# EasyEDA Pro project opendeep.pba001.eval.v01.eprj

# Schematic opendeep.pba001.eval.v01
Board Name: opendeep.pba001.eval.v01; Create Date: 2026-03-10; Page Name: coreboard; Project Name: opendeep.pba001.eval.v01; Schematic Name: opendeep.pba001.eval.v01; Update Date: 2026-04-04; Company: EasyEDA.com; Page Size: A4; Version: V1.0
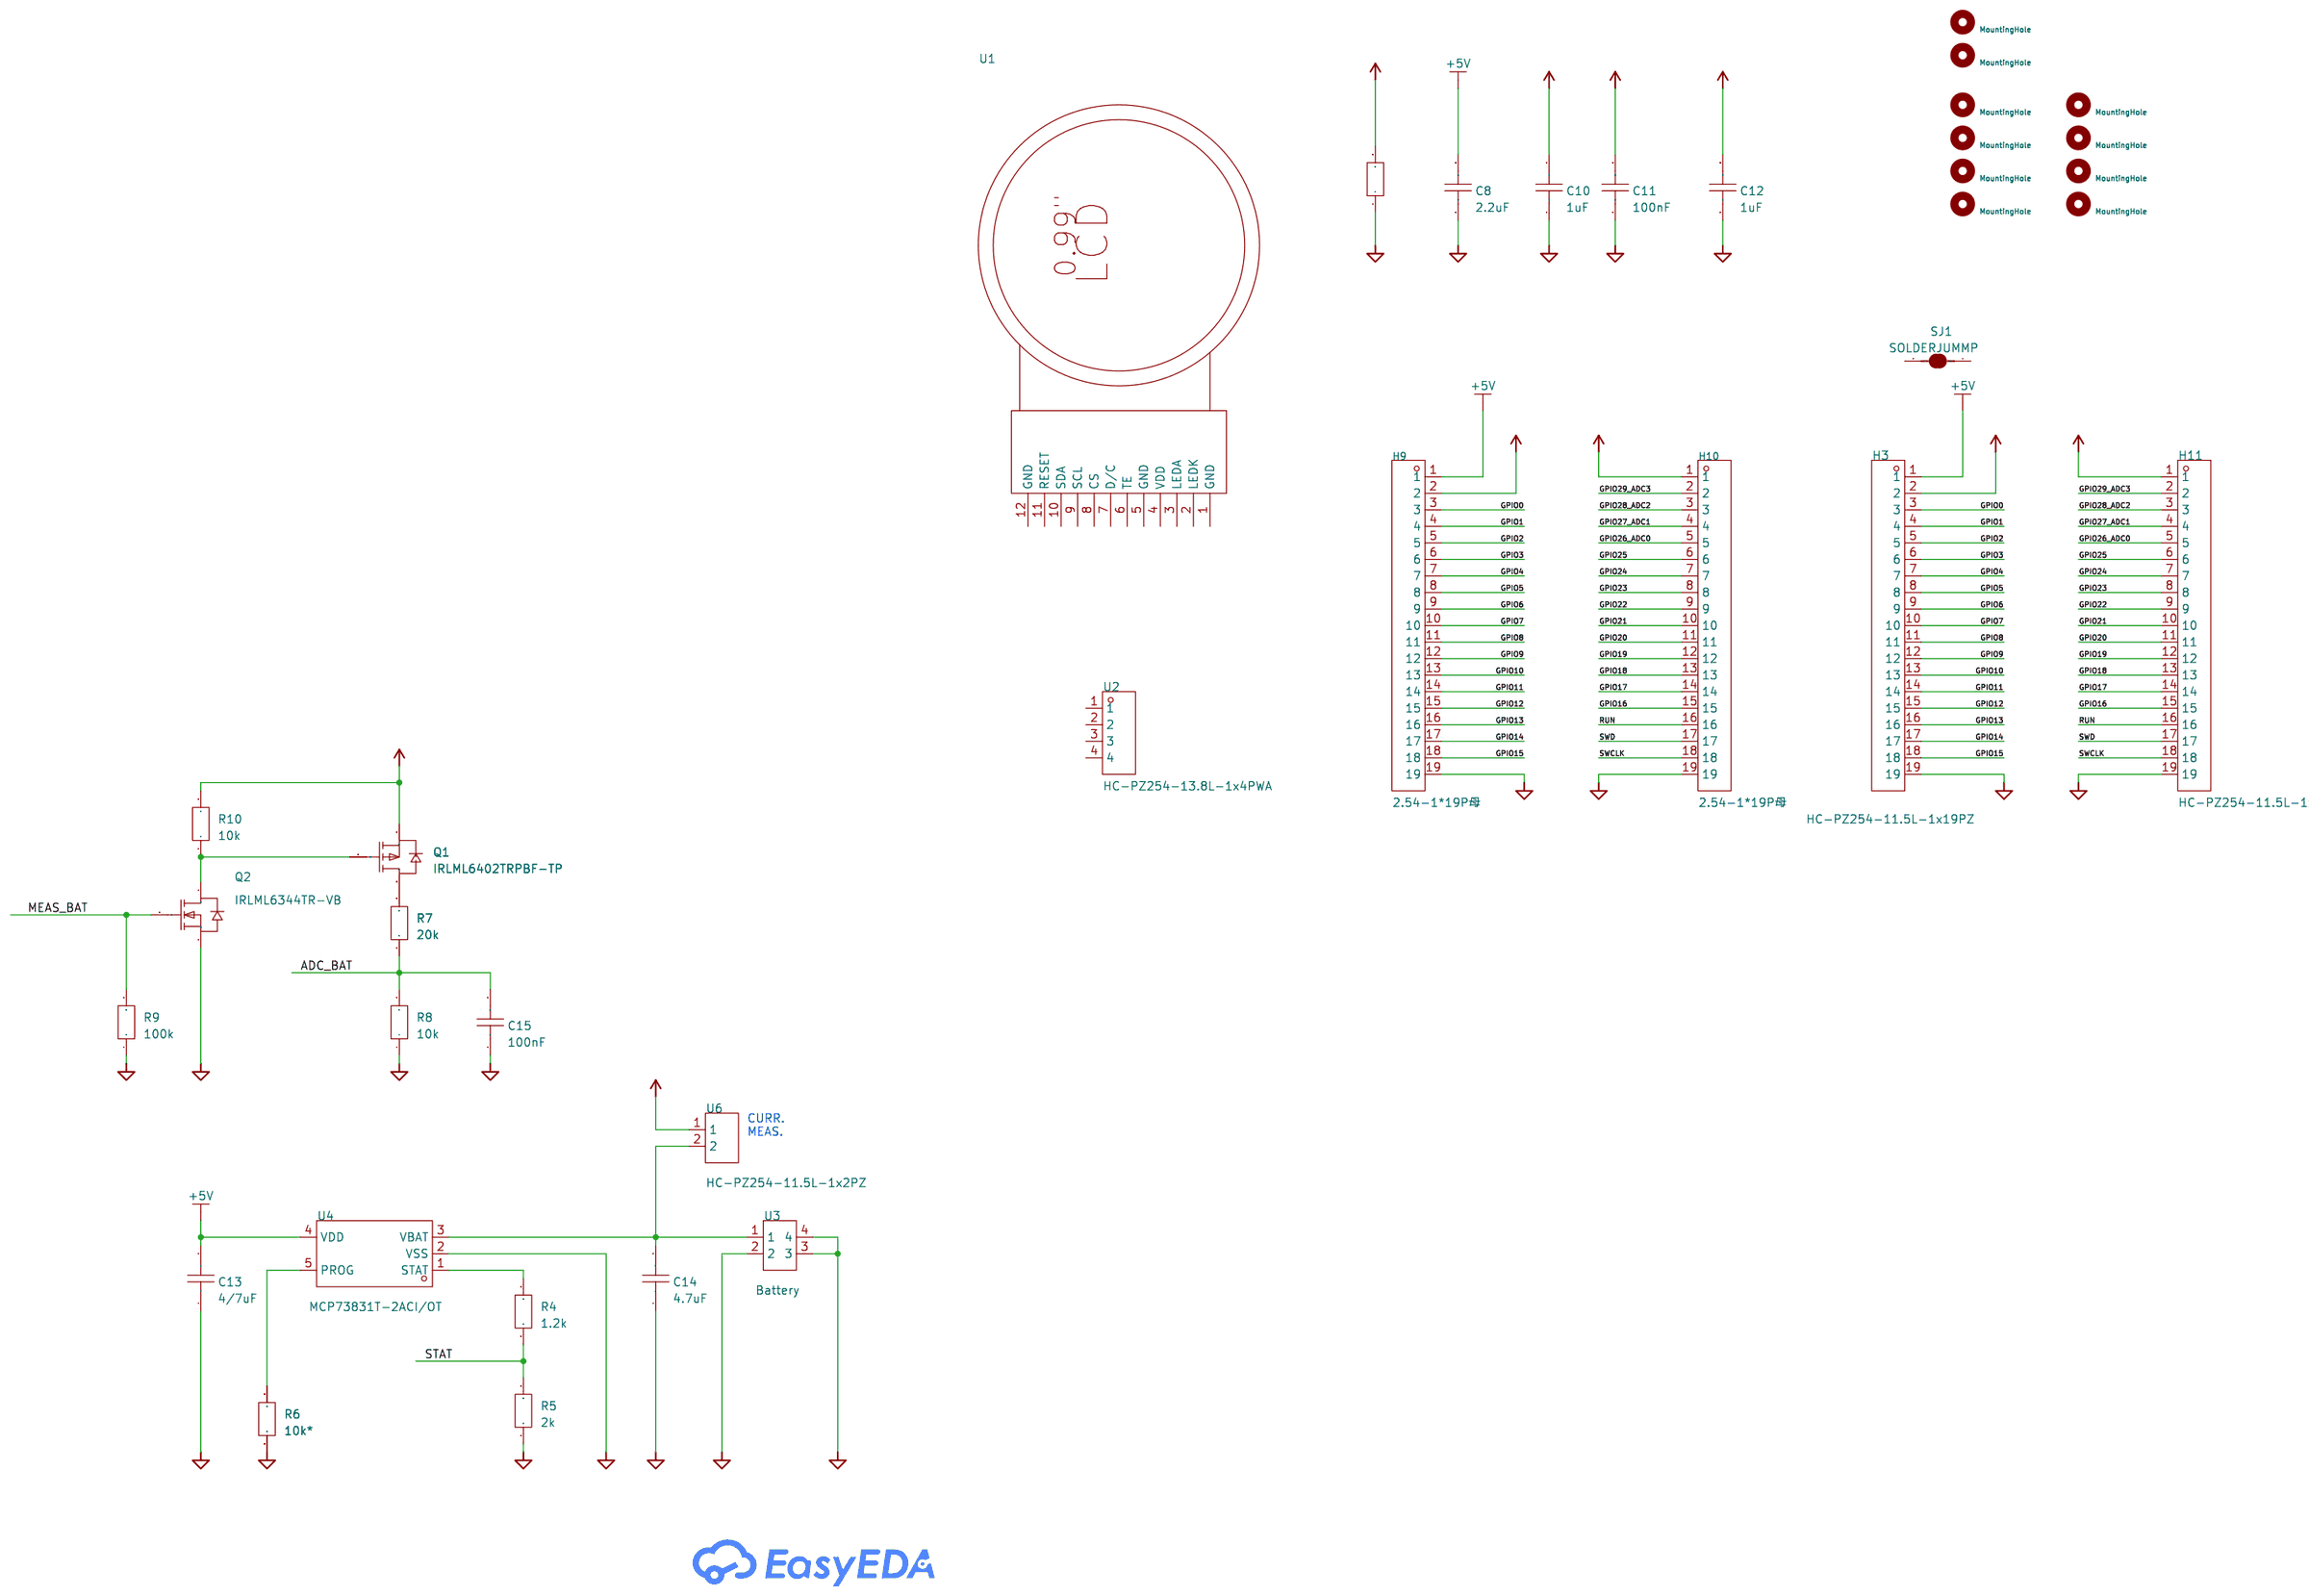
[diagram p0: schematic sheet]

## Parts
C8  2.2uF  [C0603]
C10  1uF  [C0603]
C11  100nF  [C0603]
C12  1uF  [C0603]
C13  4/7uF  [C0603]
C14  4.7uF  [C0603]
C15  100nF  [C0603]
H1  MountingHole  [MountingHole:MountingHole_2.7mm_M2.5]
H2  MountingHole  [MountingHole:MountingHole_2.7mm_M2.5]
H3  HC-PZ254-11.5L-1x19PZ  [HDR-TH_19P-P2.54-V-M]
H5  MountingHole  [MountingHole:MountingHole_2.7mm_M2.5]
H6  MountingHole  [MountingHole:MountingHole_2.7mm_M2.5]
H7  MountingHole  [MountingHole:MountingHole_2.7mm_M2.5]
H8  MountingHole  [MountingHole:MountingHole_2.7mm_M2.5]
H9  2.54-1*19P母  [HDR-TH_19P-P2.54-V-F]
H10  2.54-1*19P母  [HDR-TH_19P-P2.54-V-F]
H11  HC-PZ254-11.5L-1x19PZ  [HDR-TH_19P-P2.54-V-M]
H12  MountingHole  [MountingHole:MountingHole_2.7mm_M2.5]
H13  MountingHole  [MountingHole:MountingHole_2.7mm_M2.5]
H14  MountingHole  [MountingHole:MountingHole_2.7mm_M2.5]
H15  MountingHole  [MountingHole:MountingHole_2.7mm_M2.5]
Q1  IRLML6402TRPBF-TP  [SOT-23-3_L2.9-W1.3-P1.90-LS2.4-BR]
Q2  IRLML6344TR-VB  [SOT-23-3_L2.9-W1.3-P1.90-LS2.4-BR]
R3  DNF  [R0603]
R4  1.2k  [R0603]
R5  2k  [R0603]
R6  10k*  [R0603]
R7  20k  [R0603]
R8  10k  [R0603]
R9  100k  [R0603]
R10  10k  [R0603]
SJ1  SOLDERJUMMP  [SJ_2S-NO]
U1  -  [LCD 0.99 bottom]
U2  HC-PZ254-13.8L-1x4PWA  [HDR-TH_4P-P2.54-H-M_HC-PZ254-13.8L-1X4PWA]
U3  Battery  [CONN-SMD_2.0-2PWT]
U4  MCP73831T-2ACI/OT  [SOT-23-5_L3.0-W1.7-P0.95-LS2.8-BL]
U6  HC-PZ254-11.5L-1x2PZ  [CONN-TH_HC-PZ254-11.5L-1X2PZ]

## Library data of the parts
C8 C10-C15 = C0603C102J2GECAUTO: LCSC Part Name: 1nF ±5% 200V; Supplier Part: C2169812; Manufacturer: KEMET(基美); Supplier Footprint: 0603; JLCPCB Part Class: Extended Part; Datasheet: https://item.szlcsc.com/datasheet/C0603C102J2GECAUTO/2261877.html; Supplier: LCSC; Tolerance: ±5%; Voltage Rating: 200V; Temperature Coefficient: C0G
H1 H5-H8 H12-H15 = Mechanical_MountingHole: Attribute1: H2
H2 = Mechanical_MountingHole
H3 H11 = HC-PZ254-11.5L-1x19PZ: LCSC Part Name: 1x19P 间距:2.54mm 方针 直插; Supplier Part: C27985198; Manufacturer: HC(虹成电子); Supplier Footprint: 插件,P=2.54mm; JLCPCB Part Class: Extended Part; Datasheet: https://item.szlcsc.com/datasheet/HC-PZ254-11.5L-1x19PZ/29721156.html; Supplier: LCSC; Pin Structure: 1x19P; Pitch: 2.54mm; Circluar Pins/Square Pins: Pin Header; Mounting Type: Through Hole; Number of Rows: 1; Number of Pins: 19P; Current Rating: 3A; Length of Mating Pin: 6mm; Insulation Height: 2.5mm; Length of End Connection Pin: 3mm; Contact Material: Brass; Contact Plating: Gold; Operating Temperature: -40℃~+105℃; Color: Black
H9 H10 = 2.54-1*19P母: LCSC Part Name: 间距:2.54mm 直插; Supplier Part: C319202; Manufacturer: BOOMELE(博穆精密); Supplier Footprint: 插件,P=2.54mm; JLCPCB Part Class: Extended Part; Supplier: LCSC; Pitch: 2.54mm; Circular Hole / Square Hole: Square Hole; Mounting Type: Through Hole; Number of Rows: 1; Number of Positions: 19P; Holes Direction: Top
Q1 = IRLML6402TRPBF-TP: Supplier Part: C52205420; Manufacturer: TECH PUBLIC(台舟); Supplier Footprint: SOT-23; JLCPCB Part Class: Extended Part; Datasheet: https://item.szlcsc.com/datasheet/IRLML6402TRPBF-TP/55048147.html; Supplier: LCSC
Q2 = IRLML6344TR-VB: LCSC Part Name: 1个N沟道 耐压:30V 电流:6.5A; Supplier Part: C693370; Manufacturer: VBsemi(微碧半导体); Supplier Footprint: SOT-23; JLCPCB Part Class: Extended Part; Datasheet: https://atta.szlcsc.com/upload/public/pdf/source/20221101/67F54E55C74FC40D8CBA5BD6D3D7D1EA.pdf; Supplier: LCSC; Type: 1 N-channel; Drain to Source Voltage: 30V; Current - Continuous Drain(Id): 6.5A; Pd - Power Dissipation: 1.1W; Gate Threshold Voltage (Vgs(th)@Id): 2V; Gate Charge(Qg): 4.5nC@10V; Input Capacitance(Ciss@Vds): 335pF@15V; Operating Temperature: -55℃~+150℃
R3-R10 = RCC06031K50FKEA: LCSC Part Name: 厚膜电阻 1.5kΩ ±1% 200mW; Supplier Part: C4303195; Manufacturer: VISHAY(威世); Supplier Footprint: 0603; JLCPCB Part Class: Extended Part; Datasheet: https://item.szlcsc.com/datasheet/RCC06031K50FKEA/4873636.html; Supplier: LCSC; Type: Thick Film Resistor; Tolerance: ±1%; Power(Watts): 200mW; Temperature Coefficient: ±100ppm/℃; Operating Temperature: -55℃~+155℃
SJ1 = SOLDERJUMPERNO: Contributor: SparkFun; spicePre: S
U1 = LCD 0.99
U2 = HC-PZ254-13.8L-1x4PWA: LCSC Part Name: 1x4P 间距:2.54mm 方针 弯插; Supplier Part: C27985202; Manufacturer: HC(虹成电子); Supplier Footprint: 弯插,P=2.54mm; JLCPCB Part Class: Extended Part; Datasheet: https://atta.szlcsc.com/upload/public/pdf/source/20250106/2DDD59100DBA84A77921F70A33D05F25.pdf; Supplier: LCSC; Pin Structure: 1x4P; Pitch: 2.54mm; Circluar Pins/Square Pins: Policy; Mounting Type: Right-Angle; Number of Rows: Single Row; Number of Pins: 4P; Current Rating: 3A; Length of Mating Pin: 6mm; Insulation Height: 2.5mm; Length of End Connection Pin: 3mm; Contact Material: Brass; Contact Plating: Gold; Operating Temperature: -40℃~+105℃; Color: Black
U3 = Battery: Supplier Part: C9900011133; JLCPCB Part Class: Extended Part; Supplier: LCSC
U4 = MCP73831T-2ACI/OT: LCSC Part Name: 单节锂离子/锂聚合物充电管理控制器; Supplier Part: C424093; Manufacturer: MICROCHIP(美国微芯); Supplier Footprint: SOT-23-5; JLCPCB Part Class: Extended Part; Datasheet: https://item.szlcsc.com/datasheet/MCP73831T-2ACI%252FOT/417116.html; Supplier: LCSC; The Chip Type: Charging IC; Voltage - Supply: 3.75V~6V; Charge Current - Max: 550mA; Charging Saturation Voltage: 4.2V; Type of Battery: Lithium Battery; Number of Cells: 1; Operating Temperature: -40℃~+85℃; Battery Temperature Detection: Not supported; Supply Current (Iq): 53uA
U6 = HC-PZ254-11.5L-1x2PZ: LCSC Part Name: 1x2P 间距:2.54mm 方针 直插; Supplier Part: C27985187; Manufacturer: HC(虹成电子); Supplier Footprint: 插件,P=2.54mm; JLCPCB Part Class: Extended Part; Datasheet: https://item.szlcsc.com/datasheet/HC-PZ254-11.5L-1x2PZ/29721145.html; Supplier: LCSC; Pin Structure: 1x2P; Pitch: 2.54mm; Circluar Pins/Square Pins: Pin Header; Mounting Type: Through Hole; Number of Rows: 1; Number of Pins: 2P; Current Rating: 3A; Length of Mating Pin: 6mm; Insulation Height: 2.5mm; Length of End Connection Pin: 3mm; Contact Material: Brass; Contact Plating: Gold; Operating Temperature: -40℃~+105℃; Color: Black

## Nets
+5V: C8.2 C13.2 H3.1 H9.1 U4.4(VDD)
ADC_BAT: C15.2 R7.1 R8.2
GPIO0: H3.3 H9.3
GPIO1: H3.4 H9.4
GPIO2: H3.5 H9.5
GPIO3: H3.6 H9.6
GPIO4: H3.7 H9.7
GPIO5: H3.8 H9.8
GPIO6: H3.9 H9.9
GPIO7: H3.10 H9.10
GPIO8: H3.11 H9.11
GPIO9: H3.12 H9.12
GPIO10: H3.13 H9.13
GPIO11: H3.14 H9.14
GPIO12: H3.15 H9.15
GPIO13: H3.16 H9.16
GPIO14: H3.17 H9.17
GPIO15: H3.18 H9.18
GPIO16: H10.15 H11.15
GPIO17: H10.14 H11.14
GPIO18: H10.13 H11.13
GPIO19: H10.12 H11.12
GPIO20: H10.11 H11.11
GPIO21: H10.10 H11.10
GPIO22: H10.9 H11.9
GPIO23: H10.8 H11.8
GPIO24: H10.7 H11.7
GPIO25: H10.6 H11.6
GPIO26_ADC0: H10.5 H11.5
GPIO27_ADC1: H10.4 H11.4
GPIO28_ADC2: H10.3 H11.3
GPIO29_ADC3: H10.2 H11.2
MEAS_BAT: Q2.1(G) R9.2
POWER_+3V3: C10.2 C11.2 C12.2 H3.2 H9.2 H10.1 H11.1 R3.2
POWER_BAT: Q1.2(S) R10.2 U6.1
POWER_GND: C8.1 C10.1 C11.1 C12.1 C13.1 C14.1 C15.1 H3.19 H9.19 H10.19 H11.19 Q2.2(S) R3.1 R5.1 R6.1 R8.1 R9.1 U3.2 U3.3 U3.4 U4.2(VSS)
RUN: H10.16 H11.16
STAT: R4.1 R5.2
SWCLK: H10.18 H11.18
SWD: H10.17 H11.17
$1N21301: R4.2 U4.1(STAT)
$1N21392: R6.2 U4.5(PROG)
$1N21513: C14.2 U3.1 U4.3(VBAT) U6.2
$1N22911: Q1.3(D) R7.2
$1N22991: Q1.1(G) Q2.3(D) R10.1

Not connected (* = marked no-connect by the designer): SJ1 1 2; U1 1(GND) 2(LEDK) 3(LEDA) 4(VDD) 5(GND) 6(TE) 7(D/C) 8(CS) 9(SCL) 10(SDA) 11(RESET) 12(GND); U2 1 2 3 4

## Notes on the sheet
- CURR.
  MEAS.

# Board opendeep.pba001.eval.v01
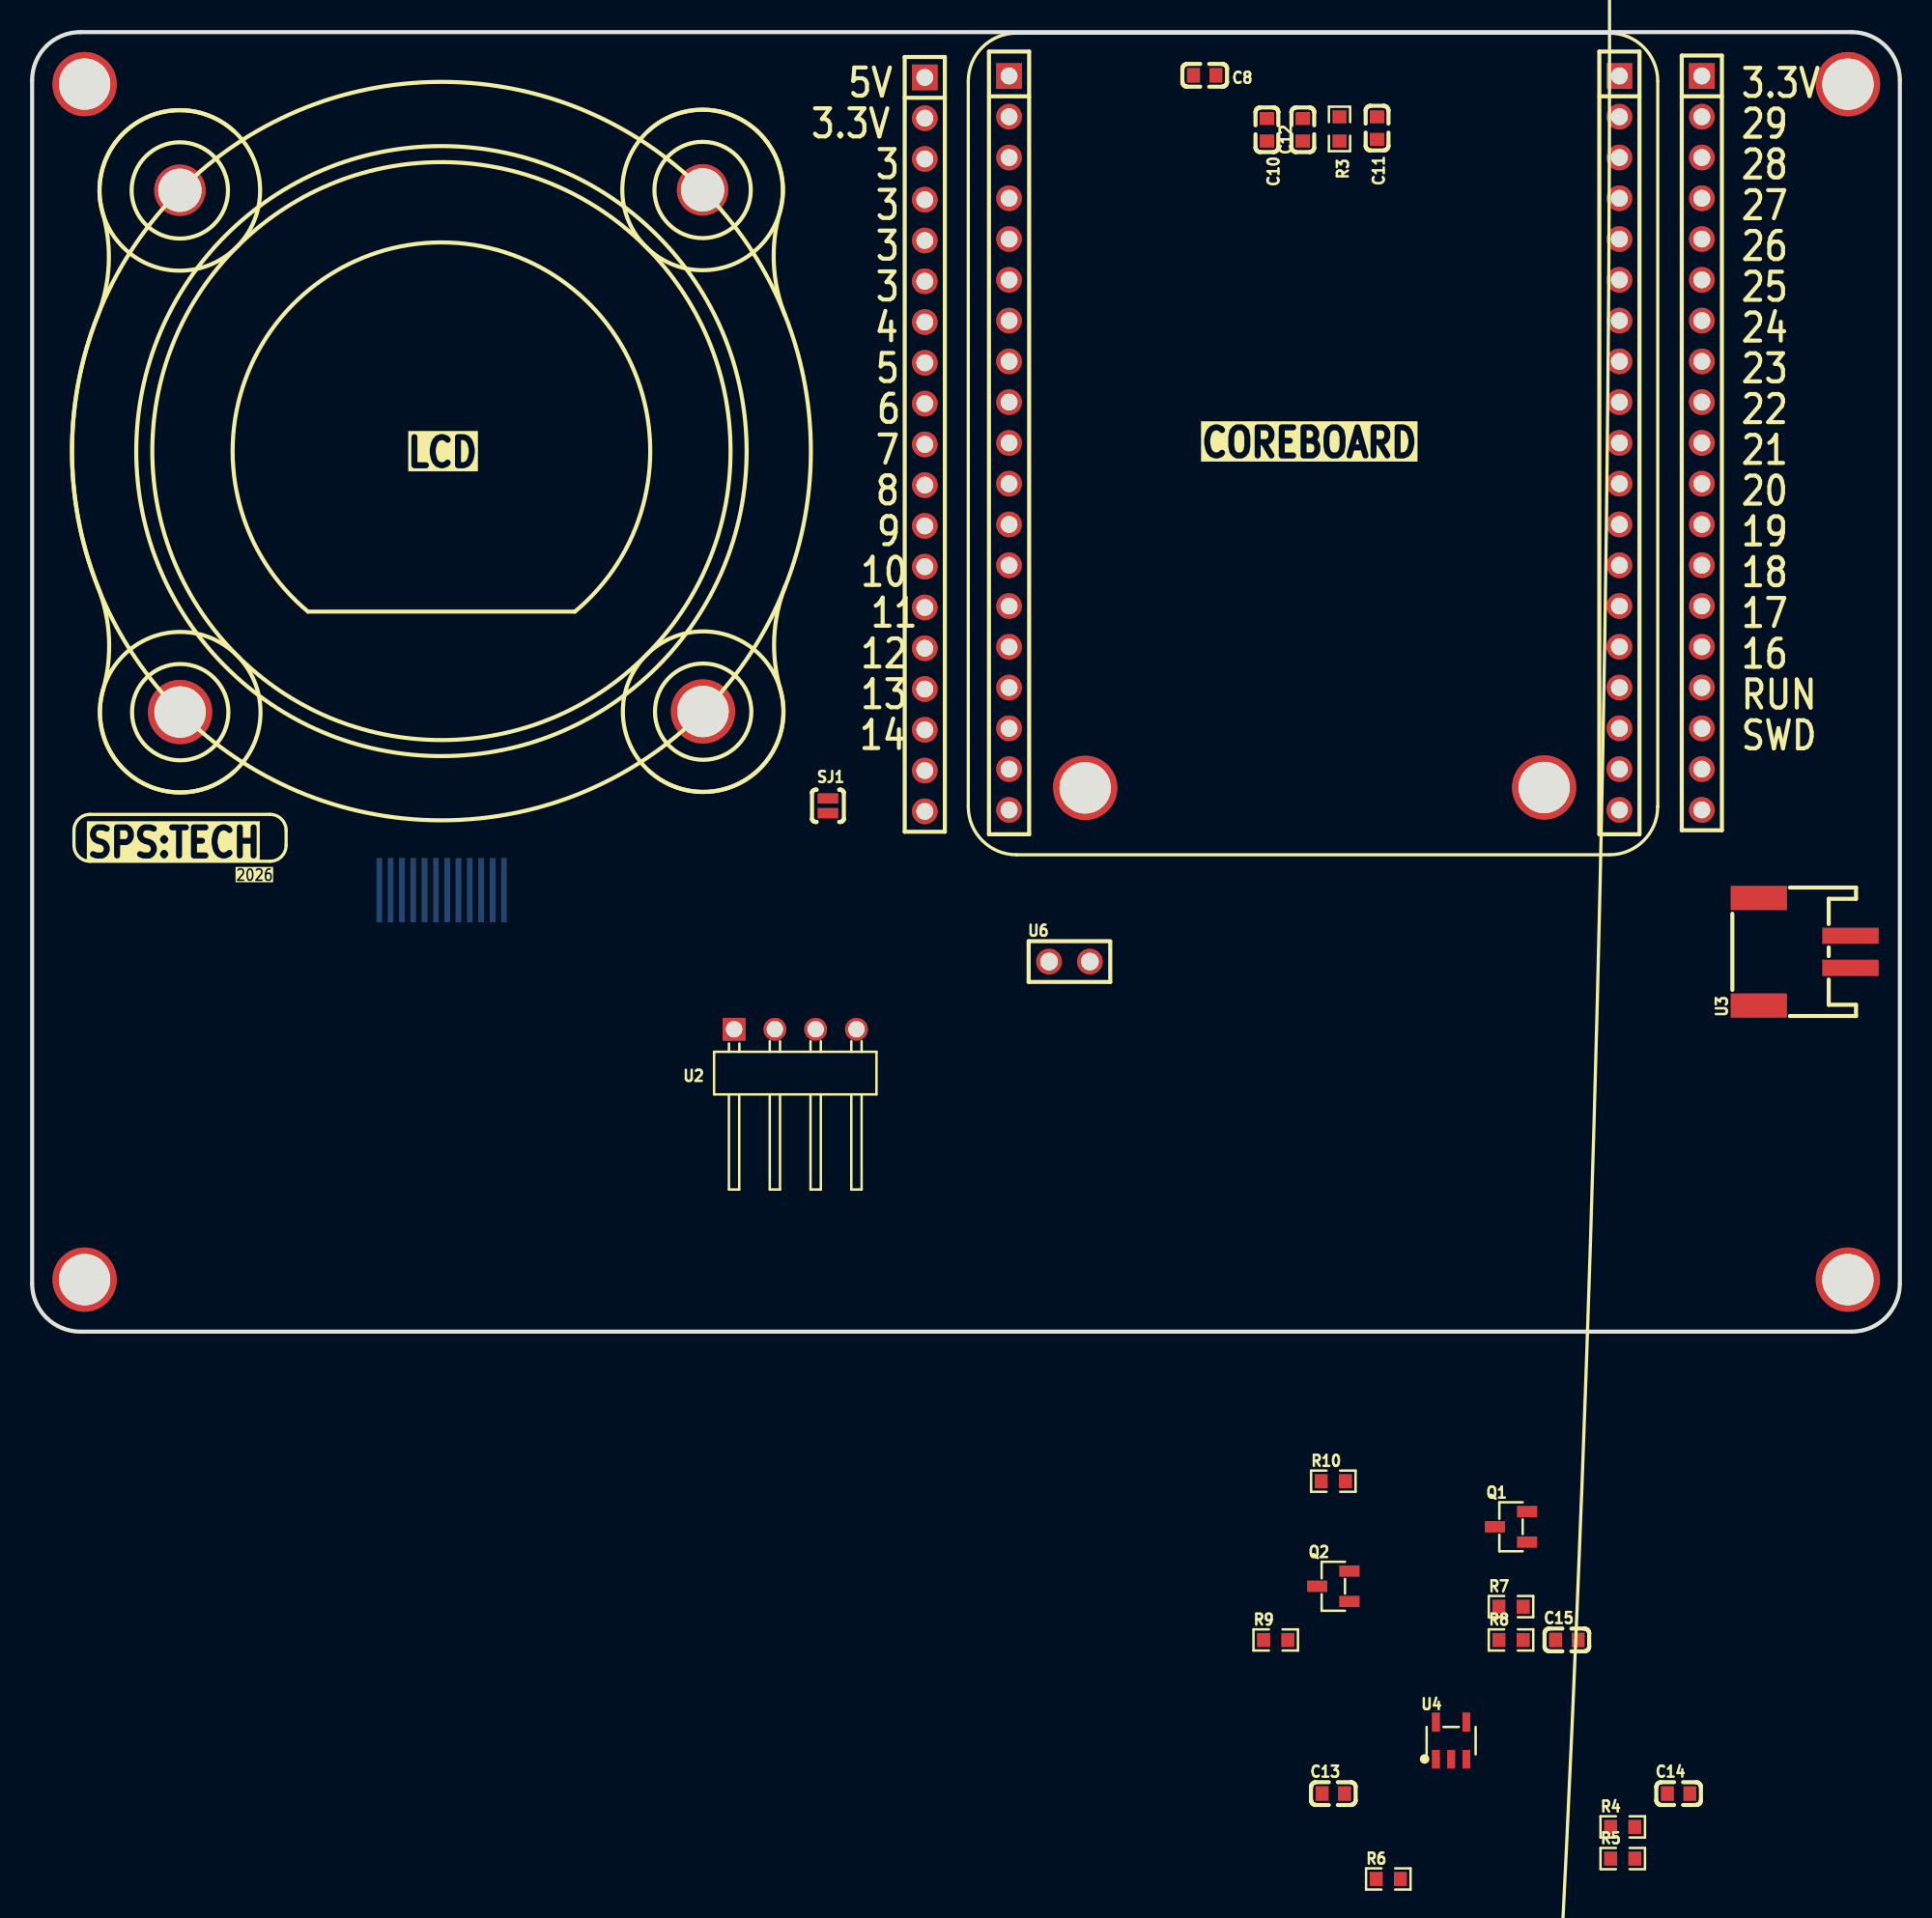
[diagram p1: board, top side]
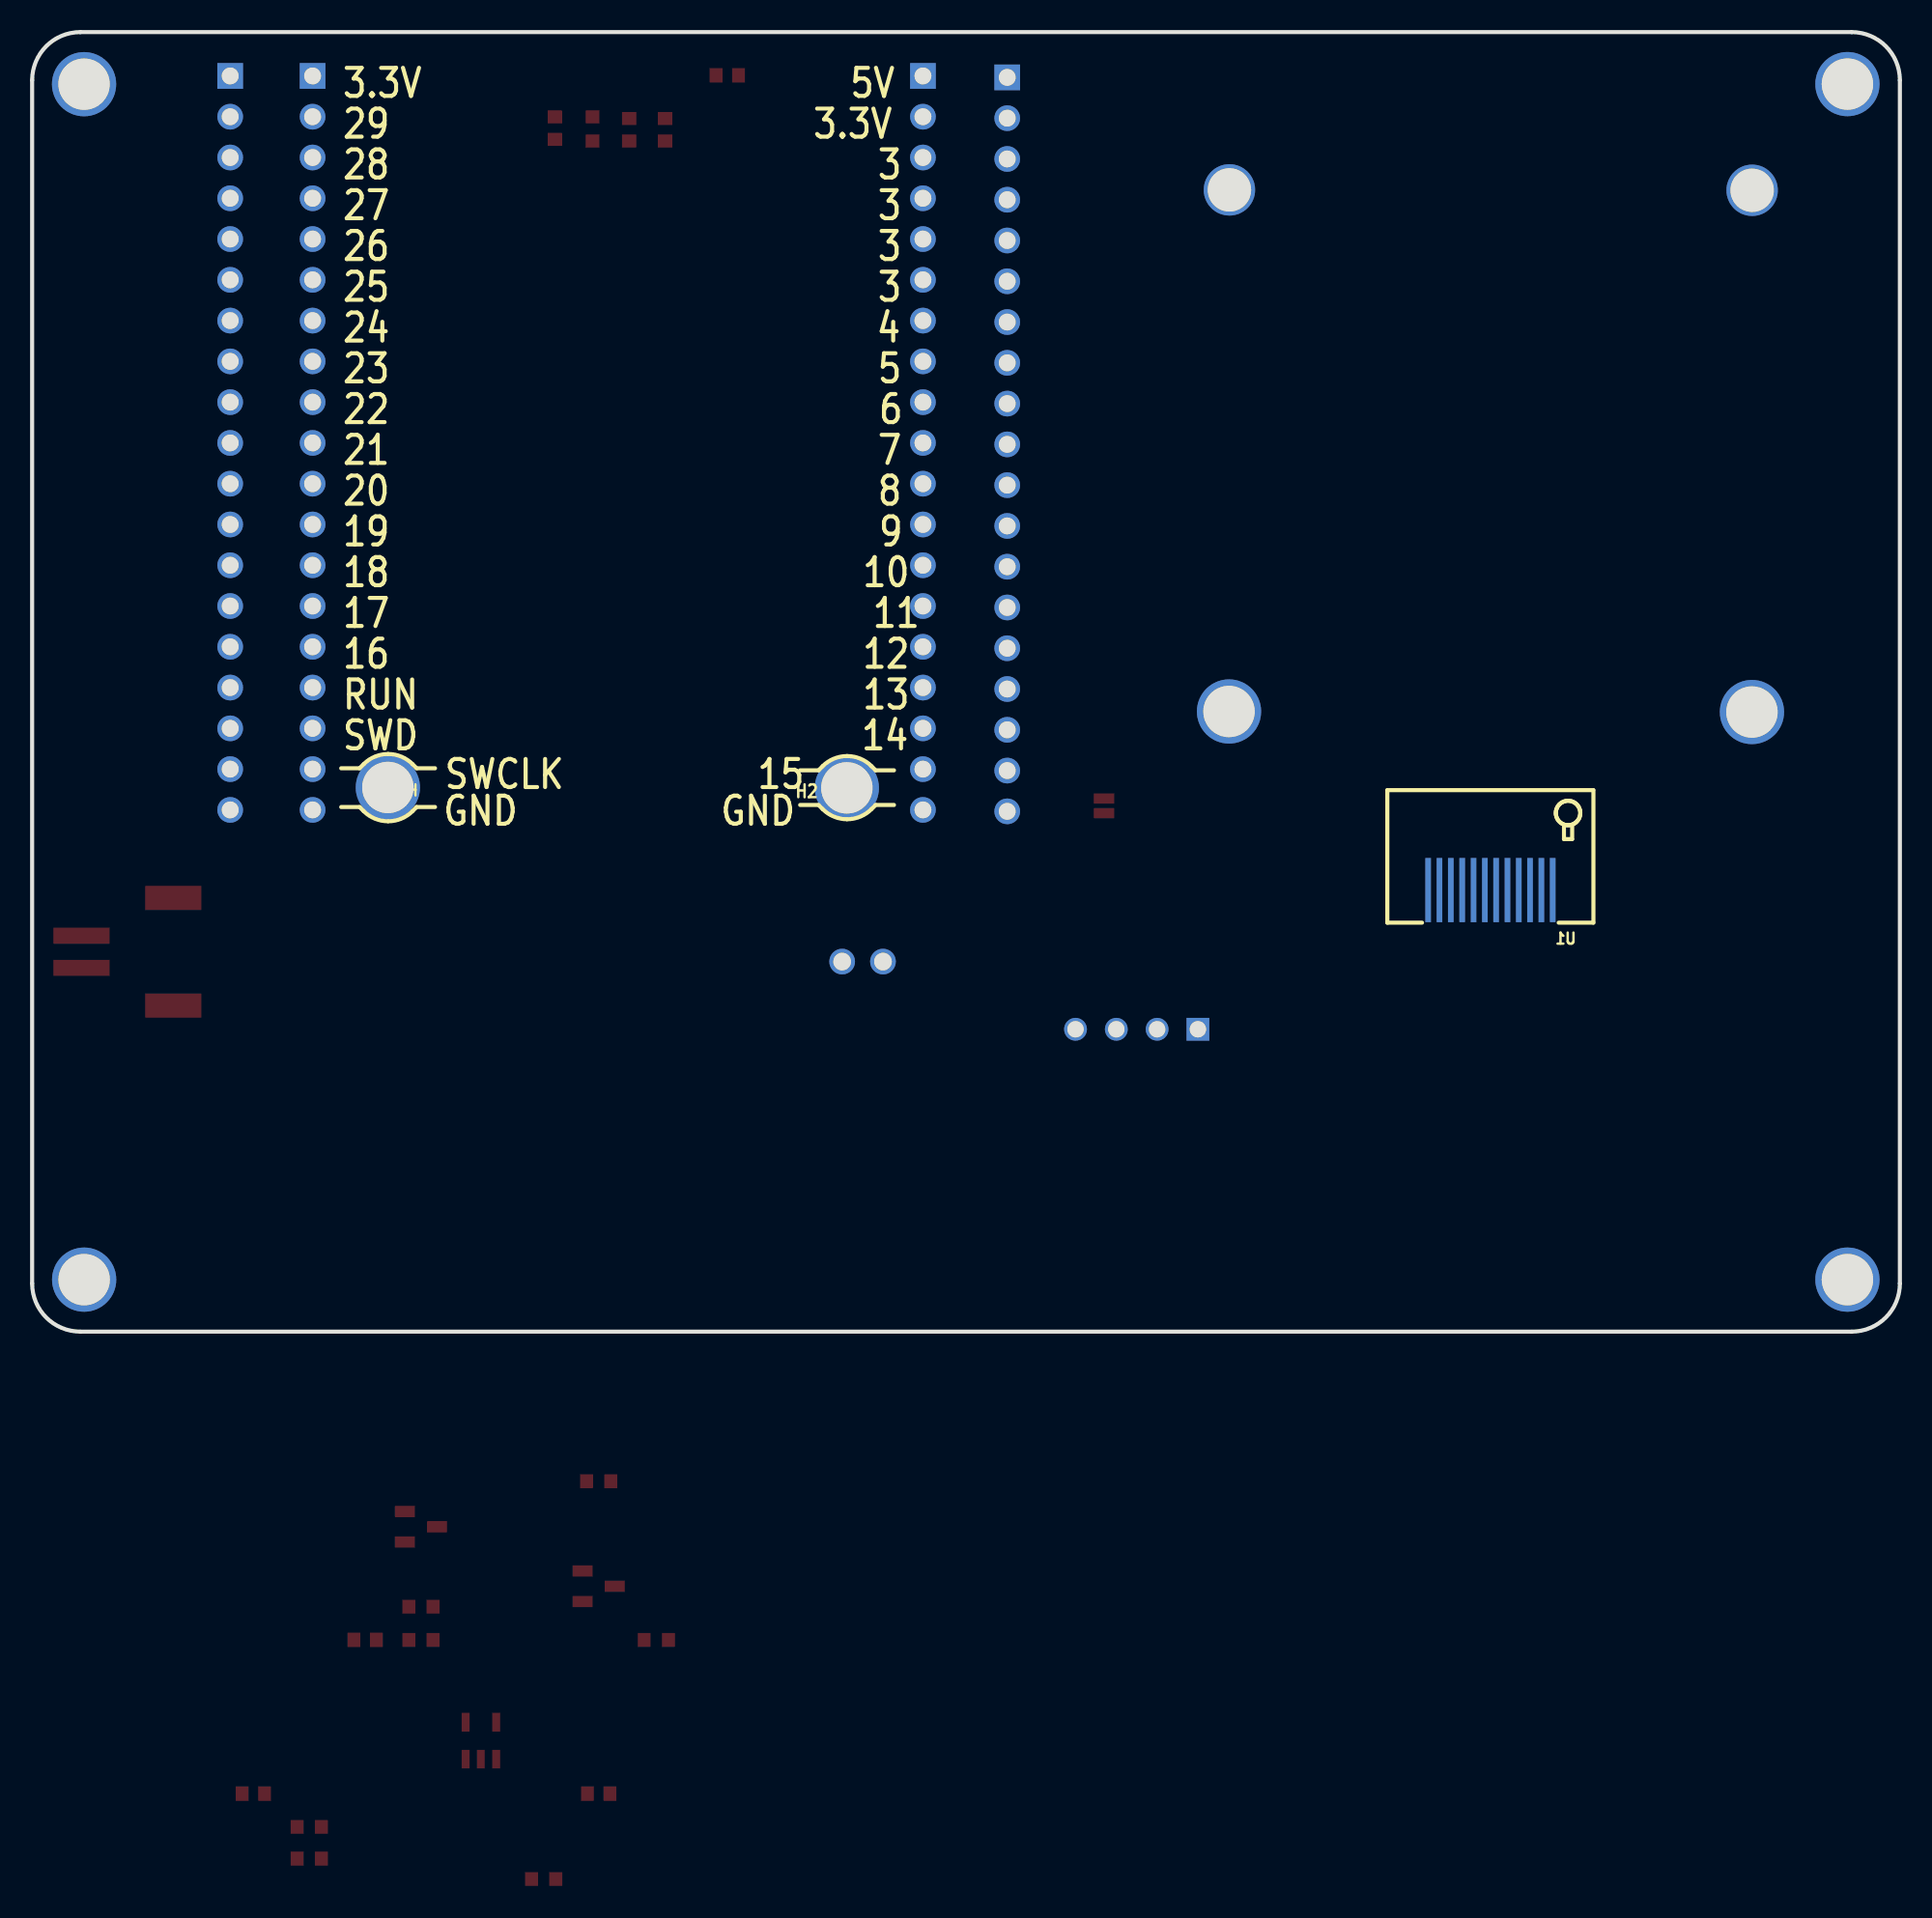
[diagram p2: board, bottom side, seen from below]

Outline 116.28 x 80.95 mm; copper layers: Top Layer, Bottom Layer. Coordinates in mm from the lower left corner of the outline.
Outline path: 0,77.95 0,3 arc(0.88,0.88) 3,0 113.28,0 arc(115.4,0.88) 116.28,3 116.28,77.95 arc(115.4,80.07) 113.28,80.95 3,80.95 arc(0.88,80.07) 0,77.95
Stack: Top Layer 0.035mm / Dielectric1 1.51mm FR4 er 4.5 / Bottom Layer 0.035mm

## Design rules (mm)
template: JLCPCB Capability(Two Layers Board)
spacing copperThickness1oz (default): track to track 0.102, other pairs 0.152 to 0.3
spacing copperThickness2oz: track to track 0.203, other pairs 0.152 to 0.3
track width copperThickness1oz (default): min 0.127, default 0.254, max 2.54
track width copperThickness2oz: min 0.203, default 0.254, max 2.54
differential pair differentialPair (default): width min 0.127, default 0.254, max 2.54; gap min 0.152, default 0.152
via viaSize (default): diameter min 0.5, default 0.61, max 10; hole min 0.3, default 0.305, max 6.3

## Placement (name value [footprint] x y rotation side)
C8  2.2uF  [C0603]  73 78.26 180 top
C10  1uF  [C0603]  76.88 74.87 90 top
C11  100nF  [C0603]  83.73 74.97 90 top
C12  1uF  [C0603]  79.11 74.87 90 top
C13  4/7uF  [C0603]  81.01 -28.78 0 top
C14  4.7uF  [C0603]  102.51 -28.78 0 top
C15  100nF  [C0603]  95.55 -19.21 0 top
H1  MountingHole  [MountingHole:MountingHole_2.7mm_M2.5]  94.14 33.9 0 top
H2  MountingHole  [MountingHole:MountingHole_2.7mm_M2.5]  65.56 33.87 0 top
H3  HC-PZ254-11.5L-1x19PZ  [HDR-TH_19P-P2.54-V-M]  55.58 55.27 270 top
H5  MountingHole  [MountingHole:MountingHole_2.7mm_M2.5]  3.27 77.71 0 top
H6  MountingHole  [MountingHole:MountingHole_2.7mm_M2.5]  3.27 3.24 0 top
H7  MountingHole  [MountingHole:MountingHole_2.7mm_M2.5]  113.04 3.24 0 top
H8  MountingHole  [MountingHole:MountingHole_2.7mm_M2.5]  113.05 77.71 0 top
H9  2.54-1*19P母  [HDR-TH_19P-P2.54-V-F]  60.82 55.36 270 top
H10  2.54-1*19P母  [HDR-TH_19P-P2.54-V-F]  98.82 55.36 270 top
H11  HC-PZ254-11.5L-1x19PZ  [HDR-TH_19P-P2.54-V-M]  103.95 55.36 270 top
H12  MountingHole  [MountingHole:MountingHole_2.7mm_M2.5]  9.21 38.6 0 top
H13  MountingHole  [MountingHole:MountingHole_2.7mm_M2.5#2]  9.2 71.1 0 top
H14  MountingHole  [MountingHole:MountingHole_2.7mm_M2.5]  41.77 38.63 0 top
H15  MountingHole  [MountingHole:MountingHole_2.7mm_M2.5#2]  41.74 71.12 0 top
Q1  IRLML6402TRPBF-TP  [SOT-23-3_L2.9-W1.3-P1.90-LS2.4-BR]  92.07 -12.16 0 top
Q2  IRLML6344TR-VB  [SOT-23-3_L2.9-W1.3-P1.90-LS2.4-BR]  81.01 -15.86 0 top
R3  DNF  [R0603]  81.4 74.92 90 top
R4  1.2k  [R0603]  99.03 -30.85 0 top
R5  2k  [R0603]  99.03 -32.83 0 top
R6  10k*  [R0603]  84.43 -34.09 0 top
R7  20k  [R0603]  92.07 -17.13 0 top
R8  10k  [R0603]  92.07 -19.21 0 top
R9  100k  [R0603]  77.42 -19.21 0 top
R10  10k  [R0603]  81.01 -9.32 0 top
SJ1  SOLDERJUMMP  [SJ_2S-NO]  49.54 32.75 90 top
U1  -  [LCD 0.99 bottom]  25.48 29.66 0 top
U2  HC-PZ254-13.8L-1x4PWA  [HDR-TH_4P-P2.54-H-M_HC-PZ254-13.8L-1X4PWA]  47.51 18.83 0 top
U3  Battery  [CONN-SMD_2.0-2PWT]  110.35 23.66 90 top
U4  MCP73831T-2ACI/OT  [SOT-23-5_L3.0-W1.7-P0.95-LS2.8-BL]  88.34 -25.48 0 top
U6  HC-PZ254-11.5L-1x2PZ  [CONN-TH_HC-PZ254-11.5L-1X2PZ]  64.58 23.05 0 top

## Footprints (pads in the part's own frame, mm; a bottom-side part is the same pattern mirrored in y, then rotated)
C0603
  rect 0.8x0.9 smd: 1(-0.7,0) 2(0.7,0)
CONN-SMD_2.0-2PWT
  rect 1x3.5 smd: 1(1,-2.85) 2(-1,-2.85)
  rect 1.5x3.5 smd: 3(3.35,2.85) 4(-3.35,2.85)
CONN-TH_HC-PZ254-11.5L-1X2PZ
  round 1.6 hole 1.1: 1(-1.27,0) 2(1.27,0)
HDR-TH_4P-P2.54-H-M_HC-PZ254-13.8L-1X4PWA
  rect 1.42x1.42 hole 1.02: 1(-3.81,0)
  round 1.42 hole 1.02: 2(-1.27,0) 3(1.27,0) 4(3.81,0)
HDR-TH_19P-P2.54-V-F
  rect 1.6x1.6 hole 1.05: 1(-22.86,0)
  round 1.6 hole 1.05: 2(-20.32,0) 3(-17.78,0) 4(-15.24,0) 5(-12.7,0) 6(-10.16,0) 7(-7.62,0) 8(-5.08,0) 9(-2.54,0) 10(0,0) 11(2.54,0) 12(5.08,0) 13(7.62,0) 14(10.16,0) 15(12.7,0) 16(15.24,0) 17(17.78,0) 18(20.32,0) 19(22.86,0)
HDR-TH_19P-P2.54-V-M
  rect 1.6x1.6 hole 1.05: 1(-22.86,0)
  round 1.6 hole 1.05: 2(-20.32,0) 3(-17.78,0) 4(-15.24,0) 5(-12.7,0) 6(-10.16,0) 7(-7.62,0) 8(-5.08,0) 9(-2.54,0) 10(0,0) 11(2.54,0) 12(5.08,0) 13(7.62,0) 14(10.16,0) 15(12.7,0) 16(15.24,0) 17(17.78,0) 18(20.32,0) 19(22.86,0)
LCD 0.99 bottom
  rect 0.35x4 smd far side: 1(3.885,-2.159) 2(3.179,-2.159) 3(2.474,-2.159) 4(1.764,-2.159) 5(1.058,-2.159) 6(0.352,-2.159) 7(-0.347,-2.159) 8(-1.054,-2.159) 9(-1.759,-2.159) 10(-2.458,-2.159) 11(-3.164,-2.159) 12(-3.869,-2.159)
MountingHole:MountingHole_2.7mm_M2.5
  round 4 hole 3.2: (0,0)
MountingHole:MountingHole_2.7mm_M2.5#2
  round 3.2 hole 2.7: (0,0)
R0603
  rect 0.806x0.864 smd: 1(-0.753,0) 2(0.753,0)
SJ_2S-NO
  rect 0.635x1.27 smd: 1(-0.457,0) 2(0.457,0)
SOT-23-3_L2.9-W1.3-P1.90-LS2.4-BR
  rect 1.25x0.7 smd: 1(1,-0.95) 2(1,0.95) 3(-1,0)
SOT-23-5_L3.0-W1.7-P0.95-LS2.8-BL
  rect 0.49x1.157 smd: 1(-0.95,-1.153) 2(0,-1.153) 3(0.95,-1.153)
  rect 0.49x1.175 smd: 4(0.95,1.153) 5(-0.95,1.153)

## Nets
As in the schematic.

Pads without a net: SJ1 1 2; U1 1 2 3 4 5 6 7 8 9 10 11 12; U2 1 2 3 4

## Text on the board
Bottom Silkscreen Layer: H2 | 6 | 9 | 3 | 5 | 7 | 8 | 4 | 11 | 10 | 12 | 13 | 14 | 5V | 3.3V | 15 | GND | SWCLK | 29 | 28 | 27 | 26 | 25 | 24 | 23 | 22 | 21 | 20 | 19 | 18 | 17 | 16 | RUN | SWD
Top Silkscreen Layer: 2026 | 3.3V | 5V | 14 | 10 | 12 | 13 | 11 | 4 | 3 | 5 | 7 | 8 | 6 | 9 | 29 | 28 | 27 | 26 | 25 | 24 | 23 | 22 | 21 | 20 | 19 | 18 | 17 | 16 | RUN | SWD | SPS:TECH | LCD | COREBOARD
